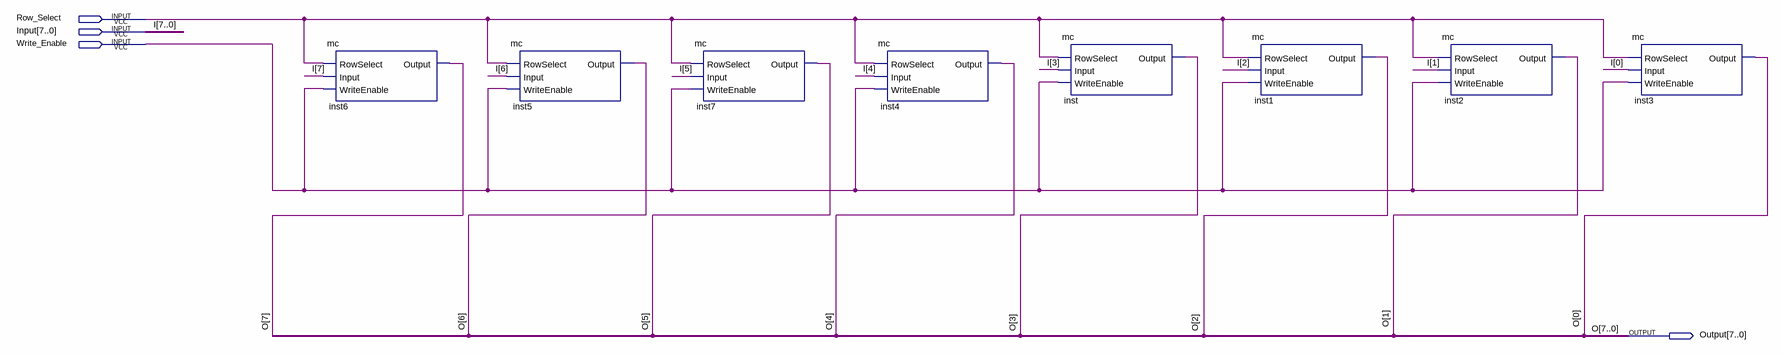
[diagram p0: schematic sheet]
// Quartus schematic byte.bdf as structural Verilog: 8 symbols, 4 pins
module \byte  (
  input  Row_Select,
  input  [7:0] Input,
  input  Write_Enable,
  output [7:0] Output
);

  mc inst6 (.RowSelect(Row_Select), .Input(Input[7]), .WriteEnable(Write_Enable), .Output(Output[7]));
  mc inst5 (.RowSelect(Row_Select), .Input(Input[6]), .WriteEnable(Write_Enable), .Output(Output[6]));
  mc inst7 (.RowSelect(Row_Select), .Input(Input[5]), .WriteEnable(Write_Enable), .Output(Output[5]));
  mc inst4 (.RowSelect(Row_Select), .Input(Input[4]), .WriteEnable(Write_Enable), .Output(Output[4]));
  mc inst (.RowSelect(Row_Select), .Input(Input[3]), .WriteEnable(Write_Enable), .Output(Output[3]));
  mc inst1 (.RowSelect(Row_Select), .Input(Input[2]), .WriteEnable(Write_Enable), .Output(Output[2]));
  mc inst2 (.RowSelect(Row_Select), .Input(Input[1]), .WriteEnable(Write_Enable), .Output(Output[1]));
  mc inst3 (.RowSelect(Row_Select), .Input(Input[0]), .WriteEnable(Write_Enable), .Output(Output[0]));

  // Other names for the same wires on the sheet: I[7:0] = Input; O[7:0] = Output
endmodule
